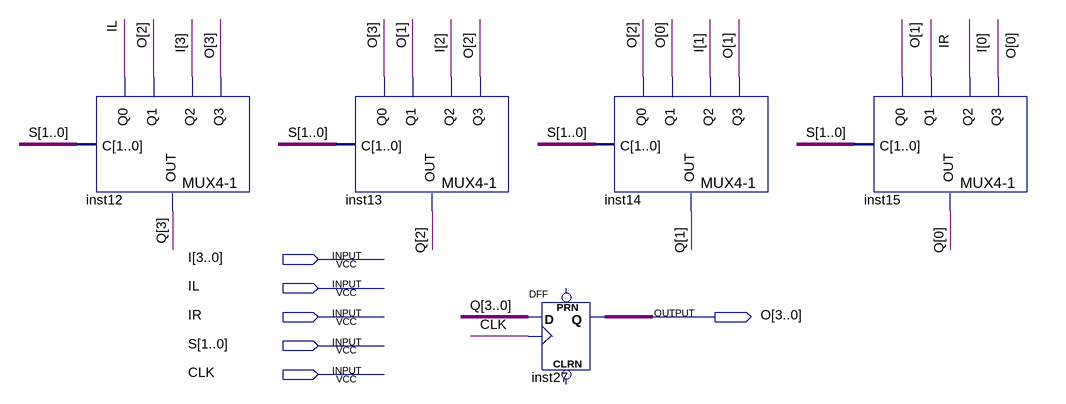
[diagram p0: schematic sheet]
// Quartus schematic SRwPL.bdf as structural Verilog: 5 symbols, 6 pins
module SRwPL (
  input  [3:0] I,
  input  IL,
  input  IR,
  input  [1:0] S,
  input  CLK,
  output [3:0] O
);

  wire [3:0] Q;

  \MUX4-1  inst12 (.Q3(O[3]), .Q2(I[3]), .Q1(O[2]), .Q0(IL), .C(S), .OUT(Q[3]));
  \MUX4-1  inst13 (.Q3(O[2]), .Q2(I[2]), .Q1(O[1]), .Q0(O[3]), .C(S), .OUT(Q[2]));
  DFF inst27[3:0] (.CLK(CLK), .D(Q), .Q(O));  // open: CLRN, PRN
  \MUX4-1  inst14 (.Q3(O[1]), .Q2(I[1]), .Q1(O[0]), .Q0(O[2]), .C(S), .OUT(Q[1]));
  \MUX4-1  inst15 (.Q3(O[0]), .Q2(I[0]), .Q1(IR), .Q0(O[1]), .C(S), .OUT(Q[0]));
endmodule
